# Altium schematic sheet SH2 - CONNECTORS.SchDoc: Power Distribution Board Rev2 - Connectors
size Letter; DrawnBy: Cindy Li; Organization: Altium Limited; Address1: L3, 12a Rodborough Rd; Address2: Frenchs Forest; Address3: NSW; Address4: Australia 2086
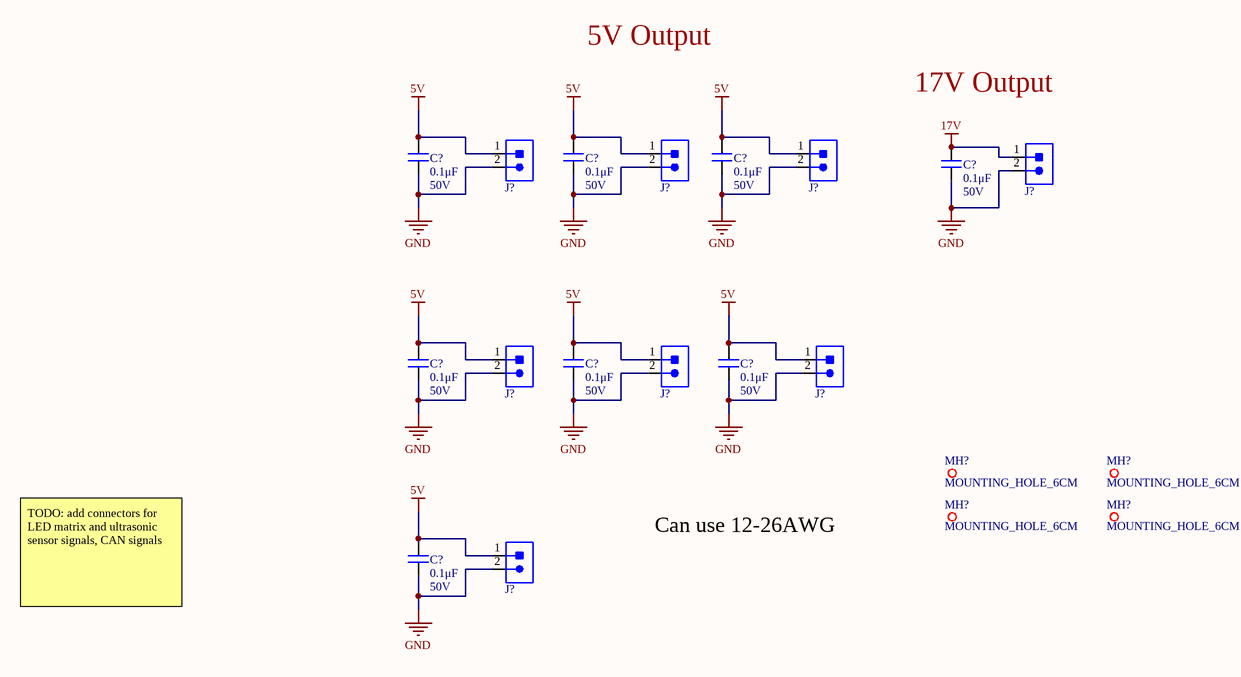
[diagram p0: SH2 - CONNECTORS.SchDoc]

## Parts
(Parts that share a designator on the sheet are numbered #1, #2 ... from top to bottom, then left to right.)
C?#1  0.1μF  Voltage Rating: 50V  [CAPC2012X140N]
C?#2  0.1μF  Voltage Rating: 50V  [CAPC2012X140N]
C?#3  0.1μF  Voltage Rating: 50V  [CAPC2012X140N]
C?#4  0.1μF  Voltage Rating: 50V  [CAPC2012X140N]
C?#5  0.1μF  Voltage Rating: 50V  [CAPC2012X140N]
C?#6  0.1μF  Voltage Rating: 50V  [CAPC2012X140N]
C?#7  0.1μF  Voltage Rating: 50V  [CAPC2012X140N]
C?#8  0.1μF  Voltage Rating: 50V  [CAPC2012X140N]
J?#1  1935161  [1935161]  (value not drawn)
J?#2  1935161  [1935161]  (value not drawn)
J?#3  1935161  [1935161]  (value not drawn)
J?#4  1935161  [1935161]  (value not drawn)
J?#5  1935161  [1935161]  (value not drawn)
J?#6  1935161  [1935161]  (value not drawn)
J?#7  1935161  [1935161]  (value not drawn)
J?#8  1935161  [1935161]  (value not drawn)
MH?#1  MOUNTING_HOLE_6CM  [MOUNTING_HOLE]
MH?#2  MOUNTING_HOLE_6CM  [MOUNTING_HOLE]
MH?#3  MOUNTING_HOLE_6CM  [MOUNTING_HOLE]
MH?#4  MOUNTING_HOLE_6CM  [MOUNTING_HOLE]

## Nets
5V: C?#1.2 C?#2.2 C?#3.2 C?#5.2 C?#6.2 C?#7.2 C?#8.2 J?#1.1 J?#2.1 J?#3.1 J?#5.1 J?#6.1 J?#7.1 J?#8.1
17V: C?#4.2 J?#4.1
GND: C?#1.1 C?#2.1 C?#3.1 C?#4.1 C?#5.1 C?#6.1 C?#7.1 C?#8.1 J?#1.2 J?#2.2 J?#3.2 J?#4.2 J?#5.2 J?#6.2 J?#7.2 J?#8.2

## Notes on the sheet
- 5V Output
- 17V Output
- Can use 12-26AWG
- TODO: add connectors for LED matrix and ultrasonic sensor signals, CAN signals
- Title
- Size:
- Date:
- Letter
- Drawn By:
- Sheet
- of
- File:

## Library data of the parts
C?#1-C?#8 = CAP_0.1uF_50V_0805: CAP CER 0.1UF 50V X7R 0805; Manufacturer 1: Murata Electronics; Manufacturer Part Number 1: GCD21BR71H104KA01L; Tolerance: 10%; Mount: Surface Mount; Case Code (Metric): 2012; Case Code (Imperial): 0805; Min Operating Temperature: -55°C; Max Operating Temperature: 125°C; Dielectric: X7R; Termination: SMD/SMT; Length: 2mm; Height: 1.25mm; Width: 0.049inch; Thickness: 0.049inch; Depth: 1.25mm; Ratings: AEC-Q200; Supplier 1: Digi-Key; Supplier Part Number 1: 490-11955-1-ND; Package: 0805 (2012 Metric); Value: 0.1μF
J?#1-J?#8 = CON_2M_TERM: TERM BLK 2POS SIDE ENTRY 5MM; Manufacturer 1: Phoenix Contact; Connector Type: Screw; Voltage Rating (DC): 320V; Max Current Rating: 16A; Max Supply Voltage: 250V; Current Rating: 17.5A; Number of Poles: 2; Number of Levels: 1; Current: 18A; Voltage: 300V; Wire Gauge (Max): 26AWG; Wire Gauge (Min): 12AWG; Approvals: UL; Supplier 1: Digi-Key; Mount: Through Hole; Number of Pins: 2; Weight: 0.067021oz; Contact Material: Copper,Tin; Insulation Material: Nylon; Housing Material: Polyamide; Housing Color: Green; Color: Green; Material: Nylon; Number of Rows: 1; Voltage Rating: 250V; Number of Positions: 2; Number of Positions Per Level: 2; Termination: Solder; Number of Contacts: 2; Number of Circuits: 2; Orientation: Straight; Length: 9mm; Height: 11.3mm; Width: 14.9mm; Pitch: 5mm; Depth: 9mm; Wire/Cable Gauge: 26AWG; Flammability Rating: UL94 V-0; REACH SVHC: Unknown; Supplier Part Number 1: 277-1667-ND; Manufacturer Part Number 1: 1935161